# EAGLE design brushed_controller (EAGLE 6.4)

## Sheet 1 of 2
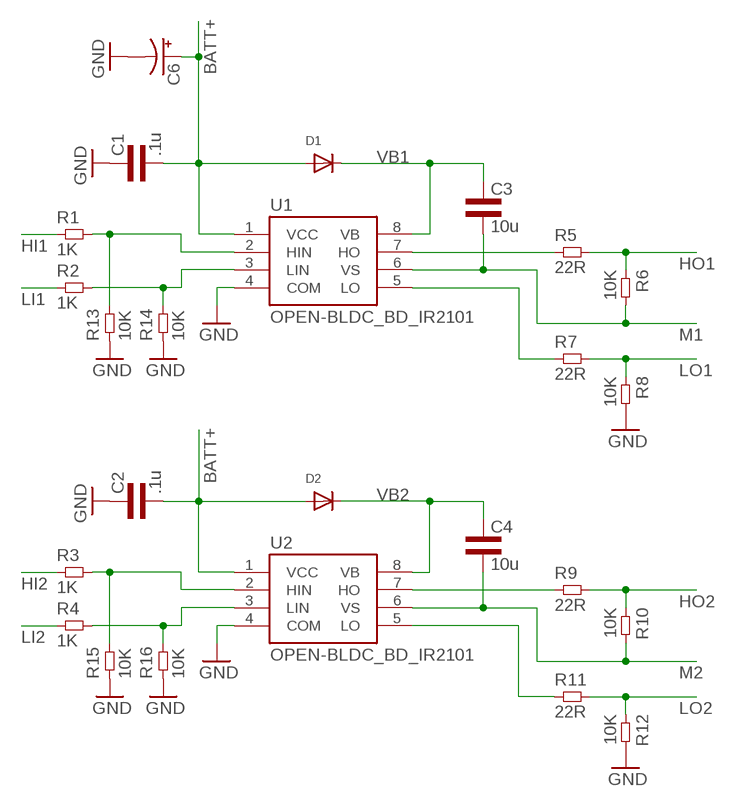
[diagram p0: schematic, sheet 1]

### Parts
C1  .1u  CAP0603L3  [0603L3]
C2  .1u  CAP0603L3  [0603L3]
C3  10u  CAP0805L3  [0805L3]
C4  10u  CAP0805L3  [0805L3]
C6  CPOL-USCT7343  [CT7343]
D1  DIODESOD-523  [SOD-523]
D2  DIODESOD-523  [SOD-523]
R1  1K  RES0603L3  [0603L3]
R2  1K  RES0603L3  [0603L3]
R3  1K  RES0603L3  [0603L3]
R4  1K  RES0603L3  [0603L3]
R5  22R  RES0805L3  [0805L3]
R6  10K  RES0805L3  [0805L3]
R7  22R  RES0805L3  [0805L3]
R8  10K  RES0805L3  [0805L3]
R9  22R  RES0805L3  [0805L3]
R10  10K  RES0805L3  [0805L3]
R11  22R  RES0805L3  [0805L3]
R12  10K  RES0805L3  [0805L3]
R13  10K  RES0603L3  [0603L3]
R14  10K  RES0603L3  [0603L3]
R15  10K  RES0603L3  [0603L3]
R16  10K  RES0603L3  [0603L3]
U1  OPEN-BLDC_BD_IR2101  [OPEN-BLDC_SO8]
U2  OPEN-BLDC_BD_IR2101  [OPEN-BLDC_SO8]

### Nets
BATT+: C1.P$2 C2.P$2 C6.+ D1.A D2.A U1.1(VCC) U2.1(VCC) ; also sheet 2
GND: C1.P$1 C2.P$1 C6.- R8.2 R12.2 R13.P$1 R14.P$1 R15.P$1 R16.P$1 U1.4(COM) U2.4(COM) ; also sheet 2
H1: R5.1 U1.7(HO)
H2: R9.1 U2.7(HO)
HI1: R1.P$1
HI2: R3.P$1
HO1: R5.2 R6.1 ; also sheet 2
HO2: R9.2 R10.1
L1: R7.1 U1.5(LO)
L2: R11.1 U2.5(LO)
LI1: R2.P$1
LI2: R4.P$1
LO1: R7.2 R8.1 ; also sheet 2
LO2: R11.2 R12.1 ; also sheet 2
M1: C3.2 R6.2 U1.6(VS) ; also sheet 2
M2: C4.2 R10.2 U2.6(VS) ; also sheet 2
N$2: R1.P$2 R13.P$2 U1.2(HIN)
N$3: R2.P$2 R14.P$2 U1.3(LIN)
N$5: R3.P$2 R15.P$2 U2.2(HIN)
N$6: R4.P$2 R16.P$2 U2.3(LIN)
VB1: C3.1 D1.K(C) U1.8(VB)
VB2: C4.1 D2.K(C) U2.8(VB)

## Sheet 2 of 2
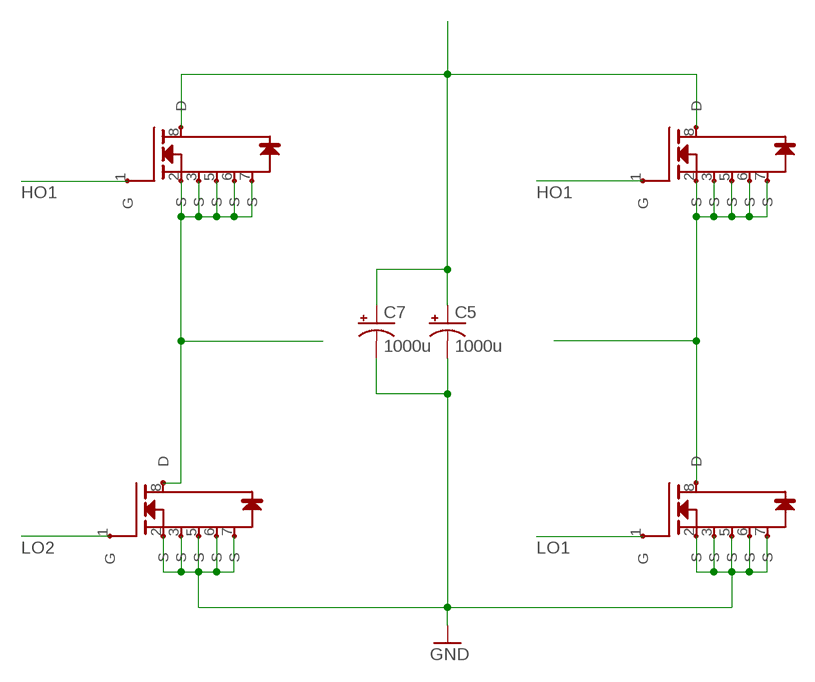
[diagram p1: schematic, sheet 2]

### Parts
C5  1000u  CPOL-USE5-13  [E5-13]
C7  1000u  CPOL-USE5-13  [E5-13]
U$1  IR-MOSFETS_IRF3805STRL-7PP  [IR-MOSFETS_D2PAK-7]
U$2  IR-MOSFETS_IRF3805STRL-7PP  [IR-MOSFETS_D2PAK-7]
U$3  IR-MOSFETS_IRF3805STRL-7PP  [IR-MOSFETS_D2PAK-7]
U$4  IR-MOSFETS_IRF3805STRL-7PP  [IR-MOSFETS_D2PAK-7]

### Nets
BATT+: C5.+ C7.+ U$1.8(D) U$3.8(D) ; also sheet 1
GND: C5.- C7.- U$2.2(S) U$2.3(S) U$2.5(S) U$2.6(S) U$2.7(S) U$4.2(S) U$4.3(S) U$4.5(S) U$4.6(S) U$4.7(S) ; also sheet 1
HO1: U$1.1(G) U$3.1(G) ; also sheet 1
LO1: U$4.1(G) ; also sheet 1
LO2: U$2.1(G) ; also sheet 1
M1: U$1.2(S) U$1.3(S) U$1.5(S) U$1.6(S) U$1.7(S) U$2.8(D) ; also sheet 1
M2: U$3.2(S) U$3.3(S) U$3.5(S) U$3.6(S) U$3.7(S) U$4.8(D) ; also sheet 1

## Library data of the parts
C1-C4 = common:CAP
C5-C7 = rcl:CPOL-US: POLARIZED CAPACITOR, American symbol
D1 D2 = adafruit:DIODE: Diode SMADIODE - SMA Surface Mount Package 20V 1A Schottky Diode Digikey: 641-1014-6-ND DO-1N4148 - Through Hole Small Current Diode SOD-123 20V 1 A (.5mV Vf) Schottky Diode - Digikey: MBRX120TPMSCT-ND SOD-323 10V 570mA (.38mV Vf, 3ns) Schottky Diode - Digikey: ZLLS410CT-ND SOD-523 30V 30mA Schottky Diode (RB751S-40TE61) - Digikey: RB751S-40TE61CT-ND SOT23-R/W - SOT23 Package (R = Solder Paste/Reflow Ovens, W = Hand-Soldering) BAT54Film 40V 300mA - Digikey: 497-7162-1-ND
R1-R16 = common:RES
U1 U2 = power_control:OPEN-BLDC_BD
U$1-U$4 = brushed_power:IR-MOSFETS_IRF3805STRL-7PP: N-Channel Max Voltage: 55V Continuous Current: 240A Power Dissapation: 300 Watt On Resistance: 2.6 mOhms Fall Time: 52 ns Footprint: D2PAK Turn-Off Delay: 80 ns

## Board
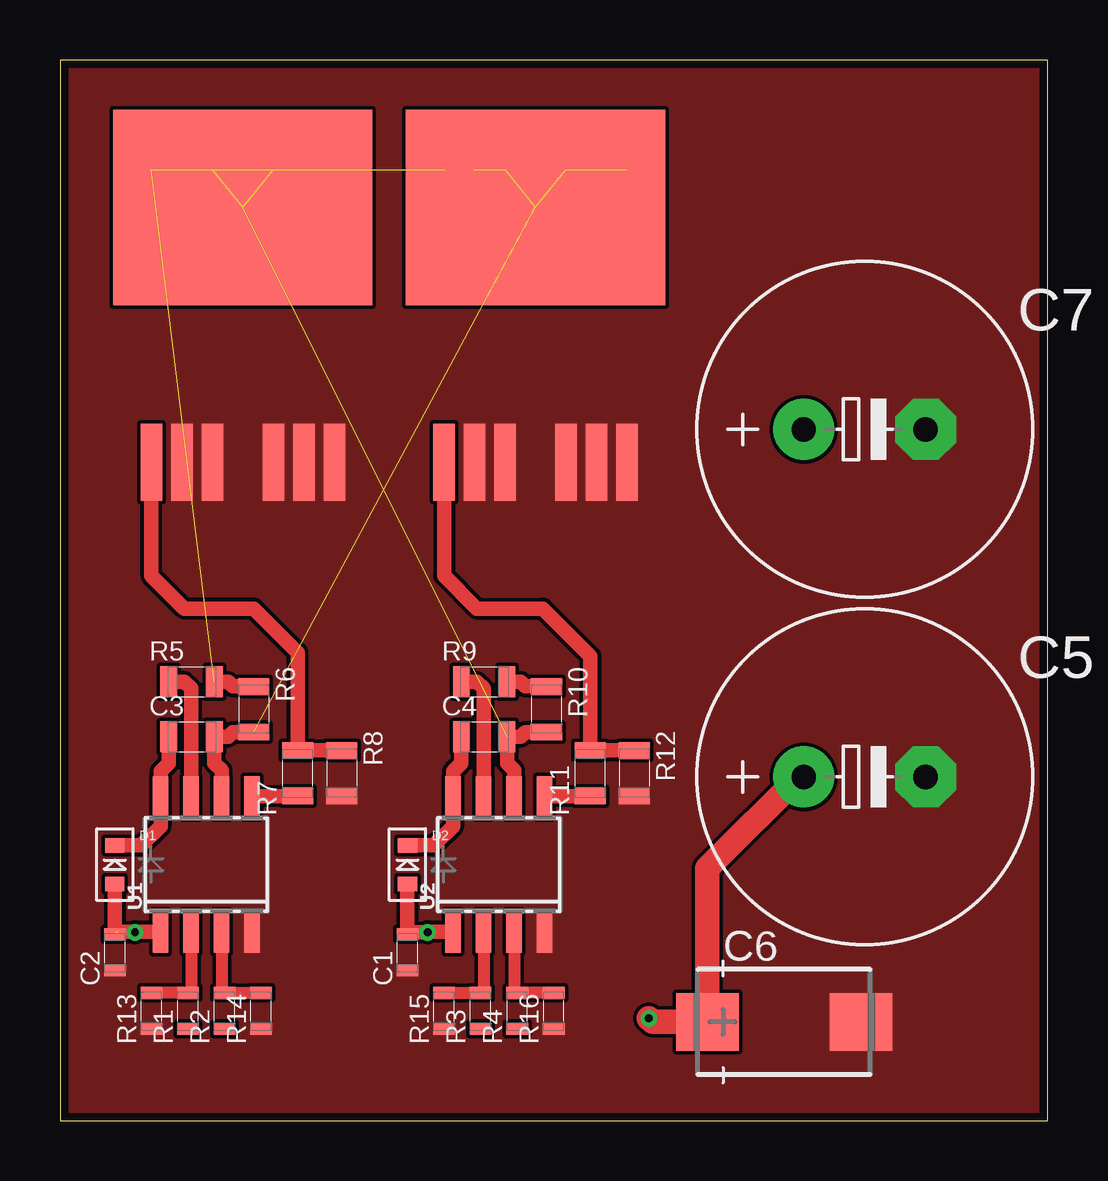
[diagram p2: board, top side]
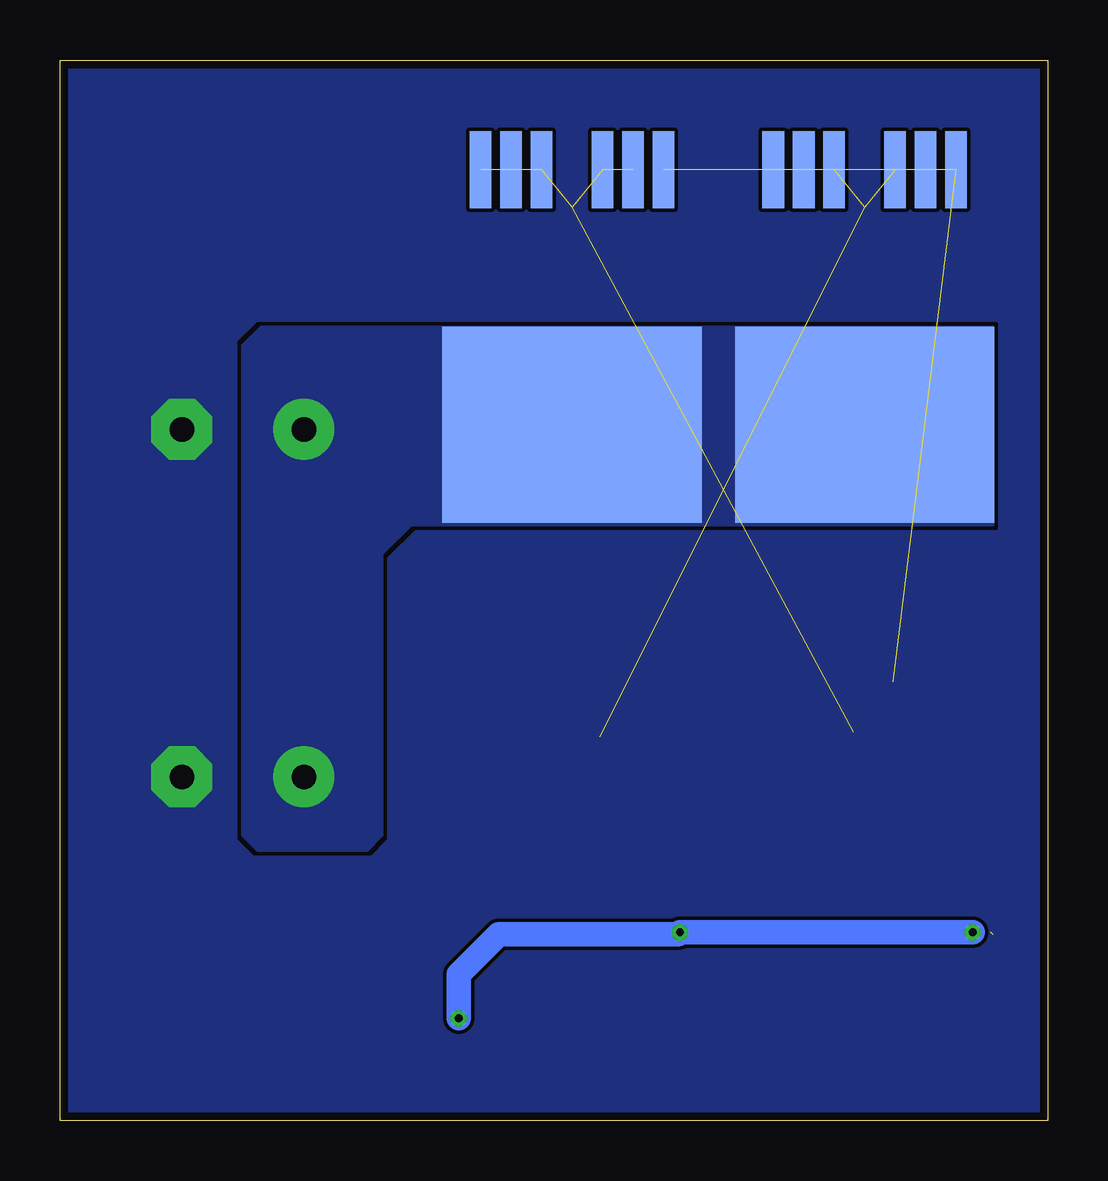
[diagram p3: board, bottom side, seen from below]

Size 41.15 x 44.2 mm. Coordinates in mm from the lower left corner, seen from the top.
Outline: 0,0 41.15,0 41.15,44.2 0,44.2 0,0
Copper layers (1*16): Top 0.035mm / dielectric 1.5mm / Bottom 0.035mm
Design rules "default *": minimum track width 6mil, minimum drill 13mil, track to track 6mil, track to pad 6mil, pad to pad 6mil, via to via 6mil, smd to smd 6mil, copper to edge 13mil, drill to drill 6mil, minimum pad ring 7mil, minimum via ring 7mil, stop-mask expansion 4mil, vias tented up to drill 16mil, thermal gap 10mil

### Footprints (pad centres in the part's own frame; a part is rotated, then mirrored left to right if it is on the bottom)
0603L3 = smd 0.5 x 0.9: P$1 -0.75,0; P$2 0.75,0
0805L3 = smd 0.7 x 1.3: 1 -0.95,0; 2 0.95,0
E5-13 = drill 1.016 pad 2.54: + -2.54,0 | drill 1.016 pad 2.54 octagon: - 2.54,0
CT7343 = smd 2.6 x 2.4: + -3.2,0; - 3.2,0
SOD-523 = smd 0.8 x 0.6: A 0,-0.8; K 0,0.8
OPEN-BLDC_SO8 = smd 0.65 x 1.75: 1 -1.905,-2.8; 2 -0.635,-2.8; 3 0.635,-2.8; 4 1.905,-2.8; 5 1.905,2.8; 6 0.635,2.8; 7 -0.635,2.8; 8 -1.905,2.8
IR-MOSFETS_D2PAK-7 = smd 0.9 x 3.2: 1 -3.81,0; 2 -2.54,0; 3 -1.27,0; 5 1.27,0; 6 2.54,0; 7 3.81,0 | smd 10.8 x 8.15: 8 0,10.625

### Placement (x,y rotation side)
C1  14.48,7.01 90 top
C2  2.29,7.01 90 top
C3  5.49,16 0 top
C4  17.68,16 0 top
C5  33.53,14.33 0 top
C6  30.18,4.11 0 top
C7  33.53,28.8 0 top
D1  2.29,10.67 0 top
D2  14.48,10.67 0 top
R1  5.33,4.57 90 top
R2  6.86,4.57 90 top
R3  17.53,4.57 90 top
R4  19.05,4.57 90 top
R5  5.49,18.29 0 top
R6  8.08,17.15 270 top
R7  9.91,14.48 90 top
R8  11.73,14.48 270 top
R9  17.68,18.29 0 top
R10  20.27,17.15 270 top
R11  22.1,14.48 90 top
R12  23.93,14.48 270 top
R13  3.81,4.57 90 top
R14  8.38,4.57 90 top
R15  16,4.57 90 top
R16  20.57,4.57 90 top
U1  6.1,10.67 0 top
U2  18.29,10.67 0 top
U$1  19.81,39.62 180 bottom
U$2  19.81,27.43 0 top
U$3  7.62,39.62 180 bottom
U$4  7.62,27.43 0 top

### Tracks (layer width: path | path; a pad name or v marks a point on that pad's centre or on a via)
BATT+  (via drill 0.33)  (1 unrouted)
  Top 0.508: 14.63,7.85 14.57,7.85 C1.P$2
  Top 0.61: D1.A 2.29,7.96 2.38,7.87 3.1,7.87 v3.12,7.85 3.14,7.87 U1.1 | D2.A 14.48,8 14.63,7.85 v15.32,7.85 15.34,7.87 U2.1
  Top 1.016: C6.+ 24.69,4.12 v24.54,4.27 | C5.+ 30.99,14.53 26.98,10.52 C6.+ | C6.+
  Bottom 1.016: v24.54,4.27 24.54,6.1 22.86,7.77 15.39,7.77 v15.32,7.85 v3.12,7.85
  pour Bottom (no thermals): 2.29,33.07 32.77,33.07 33.53,32.31 33.53,11.89 32.92,11.28 28.35,11.28 27.74,11.89 27.74,23.62 26.52,24.84 2.29,24.84
GND
  pour Top (no thermals): 0.3,43.89 40.84,43.89 40.84,0.3 0.3,0.3
  pour Bottom (rank 6, no thermals): 0.3,43.89 40.84,43.89 40.84,0.3 0.3,0.3
H1
  Top 0.61: U1.7 5.46,18.01 5.18,18.29 R5.1
H2
  Top 0.61: U2.7 17.65,18.01 17.37,18.29 R9.1
HO1  (2 unrouted)
  Top 0.61: R5.2 7.01,18.29 7.2,18.1 R6.1
HO2
  Top 0.61: R9.2 19.2,18.29 19.39,18.1 R10.1
L1
  Top 0.61: R7.1 8.06,13.53 U1.5
L2
  Top 0.61: R11.1 20.25,13.53 U2.5
LO1
  Top 0.61: R8.1 R7.2 9.91,19.51 8.08,21.34 5.18,21.34 3.81,22.71 U$4.1
LO2
  Top 0.61: R12.1 R11.2 22.1,19.35 20.12,21.34 17.37,21.34 16,22.71 U$2.1
M1  (6 unrouted)
  Top 0.61: R6.2 7.2,16.2 7.01,16 C3.2 6.44,14.9 6.73,14.6 U1.6
M2  (6 unrouted)
  Top 0.61: R10.2 19.39,16.2 19.2,16 C4.2 18.63,14.9 18.92,14.6 U2.6
N$2
  Top 0.495: U1.2 5.46,5.45 R1.P$2 R13.P$2
N$3
  Top 0.495: R14.P$2 R2.P$2 6.73,5.45 U1.3
N$5
  Top 0.495: R15.P$2 R3.P$2 17.65,5.45 U2.2
N$6
  Top 0.495: R16.P$2 R4.P$2 18.92,5.45 U2.3
VB1
  Top 0.61: D1.K 3.39,11.47 4.19,12.27 U1.8 4.19,14.55 4.54,14.9 C3.1
VB2
  Top 0.61: D2.K 15.58,11.47 16.38,12.27 U2.8 16.38,14.55 16.73,14.9 C4.1